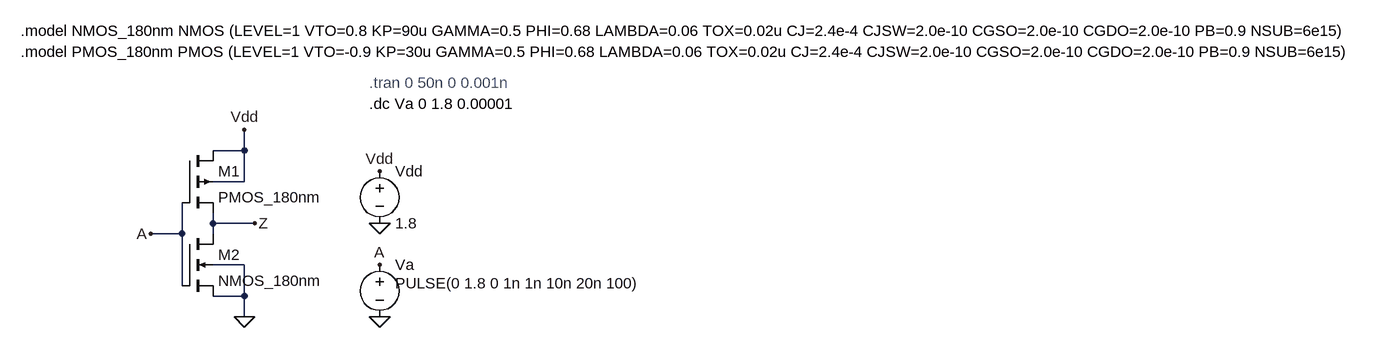
[diagram p0: schematic CMOS_simulation.asc]
CMOS_simulation.asc, the LTspice schematic file:
Version 4.1
SHEET 1 2020 680
WIRE 192 160 192 128
WIRE 192 160 144 160
WIRE 192 208 192 160
WIRE 192 208 144 208
WIRE 144 272 144 256
WIRE 208 272 144 272
WIRE 96 288 96 240
WIRE 96 288 48 288
WIRE 144 288 144 272
WIRE 192 336 144 336
WIRE 96 368 96 288
WIRE 192 384 192 336
WIRE 192 384 144 384
WIRE 192 416 192 384
FLAG 192 416 0
FLAG 48 288 A
FLAG 208 272 Z
FLAG 400 272 0
FLAG 400 192 Vdd
FLAG 400 336 A
FLAG 400 416 0
FLAG 192 128 Vdd
SYMBOL voltage 400 176 R0
WINDOW 123 0 0 Left 0
WINDOW 39 0 0 Left 0
SYMATTR InstName Vdd
SYMATTR Value 1.8
SYMBOL voltage 400 320 R0
WINDOW 123 0 0 Left 0
WINDOW 39 0 0 Left 0
WINDOW 3 24 44 Left 2
SYMATTR InstName Va
SYMATTR Value PULSE(0 1.8 0 1n 1n 10n 20n 100)
SYMBOL pmos4 96 160 R0
SYMATTR InstName M1
SYMATTR Value PMOS_180nm
SYMATTR Value2 l=0.18u w=2u
SYMBOL nmos4 96 288 R0
SYMATTR InstName M2
SYMATTR Value NMOS_180nm
SYMATTR Value2 l=0.18u w=1u
TEXT -152 -24 Left 2 !.model NMOS_180nm NMOS (LEVEL=1 VTO=0.8 KP=90u GAMMA=0.5 PHI=0.68 LAMBDA=0.06 TOX=0.02u CJ=2.4e-4 CJSW=2.0e-10 CGSO=2.0e-10 CGDO=2.0e-10 PB=0.9 NSUB=6e15)
TEXT -152 8 Left 2 !.model PMOS_180nm PMOS (LEVEL=1 VTO=-0.9 KP=30u GAMMA=0.5 PHI=0.68 LAMBDA=0.06 TOX=0.02u CJ=2.4e-4 CJSW=2.0e-10 CGSO=2.0e-10 CGDO=2.0e-10 PB=0.9 NSUB=6e15)
TEXT 384 88 Left 2 !.dc Va 0 1.8 0.00001
TEXT 384 56 Left 2 ;.tran 0 50n 0 0.001n

The netlist it stands for:
* CMOS_simulation.asc
Vdd Vdd 0 1.8
Va A 0 PULSE(0 1.8 0 1n 1n 10n 20n 100)
M1 Vdd A Z Vdd PMOS_180nm l=0.18u w=2u
M2 Z A 0 0 NMOS_180nm l=0.18u w=1u
.model NMOS NMOS
.model PMOS PMOS
.lib standard.mos
.model NMOS_180nm NMOS (LEVEL=1 VTO=0.8 KP=90u GAMMA=0.5 PHI=0.68 LAMBDA=0.06 TOX=0.02u CJ=2.4e-4 CJSW=2.0e-10 CGSO=2.0e-10 CGDO=2.0e-10 PB=0.9 NSUB=6e15)
.model PMOS_180nm PMOS (LEVEL=1 VTO=-0.9 KP=30u GAMMA=0.5 PHI=0.68 LAMBDA=0.06 TOX=0.02u CJ=2.4e-4 CJSW=2.0e-10 CGSO=2.0e-10 CGDO=2.0e-10 PB=0.9 NSUB=6e15)
.dc Va 0 1.8 0.00001
* .tran 0 50n 0 0.001n
.backanno
.end